# Altium schematic sheet AudioAndWifi.SchDoc: =ProjectTitle
size B; Engineer: H. Collector; Organization: IMR Engineering; Address1: 3621 Gin Way; Address2: Snellville, GA 30039; Address3: USA; SheetNumber: 1; SheetTotal: 7
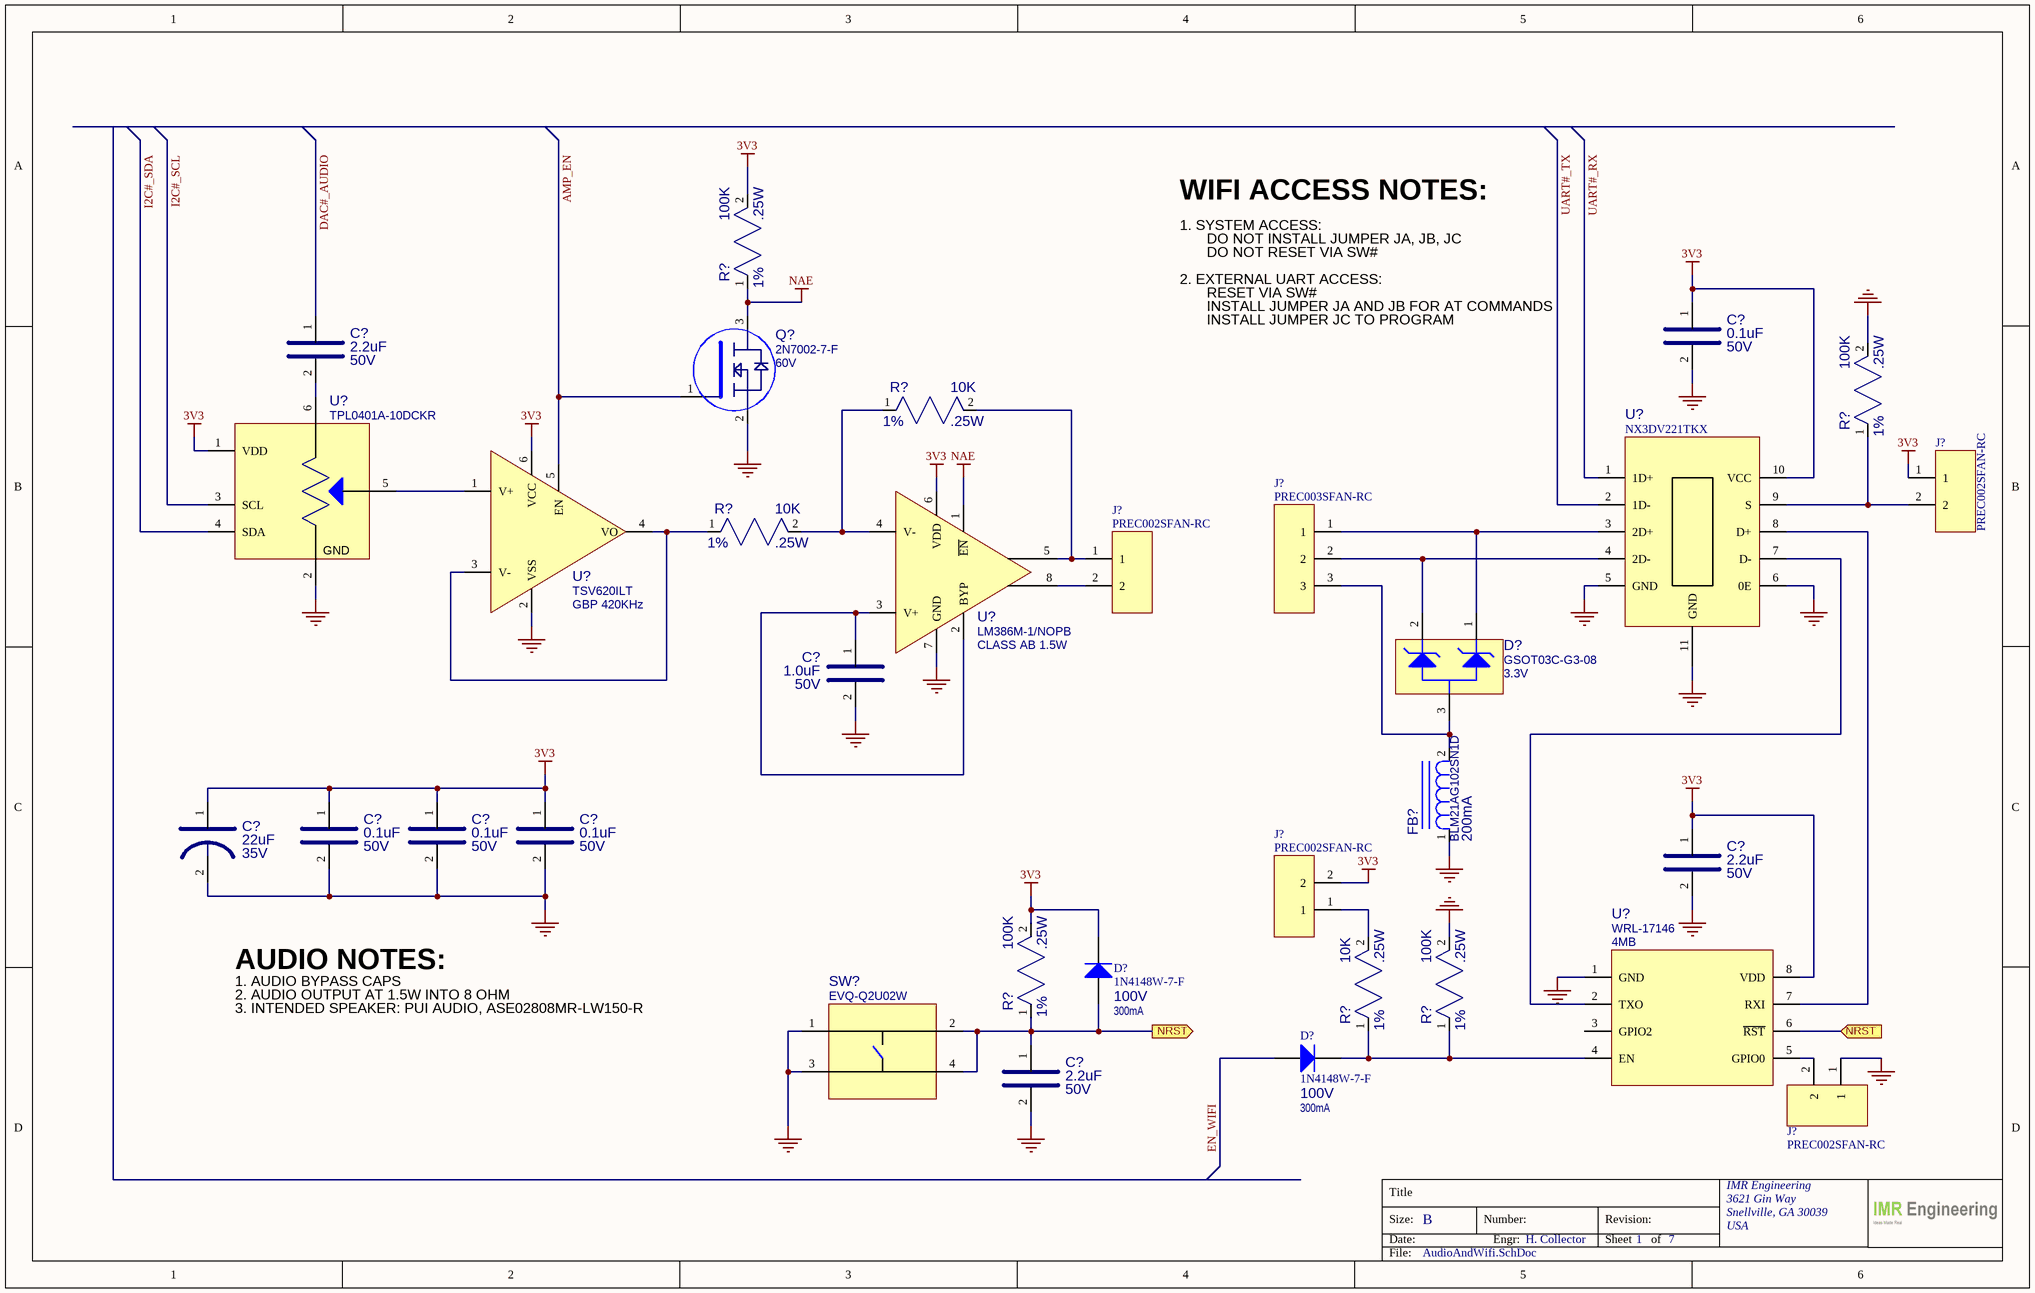
[diagram p0: AudioAndWifi.SchDoc]

## Parts
(Parts that share a designator on the sheet are numbered #1, #2 ... from top to bottom, then left to right.)
C?#1  value 0.1uF  VOLTAGE: 50V  [CAP_0805]  (hidden comment: 08055C104KAT2A)
C?#2  value 2.2uF  VOLTAGE: 50V  [CAP_0805]  (hidden comment: UMK212BB7225MG-T)
C?#3  value 1.0uF  VOLTAGE: 50V  [CAP_0805]  (hidden comment: UMK212B7105MGHT)
C?#4  value 0.1uF  VOLTAGE: 50V  [CAP_0805]  (hidden comment: 08055C104KAT2A)
C?#5  value 0.1uF  VOLTAGE: 50V  [CAP_0805]  (hidden comment: 08055C104KAT2A)
C?#6  value 0.1uF  VOLTAGE: 50V  [CAP_0805]  (hidden comment: 08055C104KAT2A)
C?#7  value 22uF  VOLTAGE: 35V  [CAP_ALE_SMD_6.6x6.6]  (hidden comment: UZS1C220MCL1GB)  (net tie, no BOM)
C?#8  value 2.2uF  VOLTAGE: 50V  [CAP_0805]  (hidden comment: UMK212BB7225MG-T)
C?#9  value 2.2uF  VOLTAGE: 50V  [CAP_0805]  (hidden comment: UMK212BB7225MG-T)
D?#1  value 3.3V  [SOT-23]  (hidden comment: GSOT03C-G3-08)
D?#2  value 100V  CURRENT: 300mA  [SOD123]  (hidden comment: 1N4148W-7-F)
D?#3  value 100V  CURRENT: 300mA  [SOD123]  (hidden comment: 1N4148W-7-F)
FB?  value 200mA  [RES_0805]  (hidden comment: BLM21AG102SN1D)
J?#1  PREC002SFAN-RC  [HDR_1X2_100MILL]
J?#2  PREC003SFAN-RC  [HDR_1X3_100MILL]
J?#3  PREC002SFAN-RC  [HDR_1X2_100MILL]
J?#4  PREC002SFAN-RC  [HDR_1X2_100MILL]
J?#5  PREC002SFAN-RC  [HDR_1X2_100MILL]
Q?  value 60V  [SOT-23]  (hidden comment: 2N7002-7-F)
R?#1  value 100K  TOLERANCE: 1%  POWER: .25W  [PMG_RES_0805]  (hidden comment: RK73H2ATTD1003F)
R?#2  value 10K  TOLERANCE: 1%  POWER: .25W  [RES_0805]  (hidden comment: SG73S2ATTD1002F)
R?#3  value 100K  TOLERANCE: 1%  POWER: .25W  [PMG_RES_0805]  (hidden comment: RK73H2ATTD1003F)
R?#4  value 10K  TOLERANCE: 1%  POWER: .25W  [RES_0805]  (hidden comment: SG73S2ATTD1002F)
R?#5  value 100K  TOLERANCE: 1%  POWER: .25W  [PMG_RES_0805]  (hidden comment: RK73H2ATTD1003F)
R?#6  value 10K  TOLERANCE: 1%  POWER: .25W  [RES_0805]  (hidden comment: SG73S2ATTD1002F)
R?#7  value 100K  TOLERANCE: 1%  POWER: .25W  [PMG_RES_0805]  (hidden comment: RK73H2ATTD1003F)
SW?  EVQ-Q2U02W  [SW_EVQ-Q2U02W]
U?#1  value 10K  TOLERANCE: 20%  POWER: 5.5V  [SOT-363_6-TSSOP_SC-88]  (hidden comment: TPL0401A-10DCKR)
U?#2  value GBP 420KHz  [SOT-363_6-TSSOP_SC-88]  (hidden comment: TSV620ILT)
U?#3  value CLASS AB 1.5W  [SO-8]  (hidden comment: LM386M-1/NOPB)
U?#4  NX3DV221TKX  [PMG_NX3DV221TKX]
U?#5  value 4MB  [WRL-17146]  (hidden comment: WRL-17146)

## Ports
NRST (in), NRST (out)

## Nets
3V3: C?#1.1 C?#4.1 C?#5.1 C?#6.1 C?#7.1 C?#8.1 D?#2.2(K) J?#1.1 J?#4.2 R?#1.2 R?#5.2 U?#1.1(VDD) U?#2.6(VCC) U?#3.6(VDD) U?#4.10(VCC) U?#5.8(VDD)
GND: C?#1.2 C?#3.2 C?#4.2 C?#5.2 C?#6.2 C?#7.2 C?#8.2 C?#9.2 FB?.1 J?#5.1 Q?.2(E) R?#3.2 R?#7.2 SW?.1(B) SW?.3(A) U?#1.2(GND) U?#2.2(VSS) U?#3.7(GND) U?#4.5(GND) U?#4.6(0E) U?#4.11(GND) U?#5.1(GND)
NAE: Q?.3(C) R?#1.1 U?#3.1(~{EN})
AMP_EN: Q?.1(B) U?#2.5(EN)
DAC#_AUDIO: C?#2.1
EN_WIFI: D?#3.1(A)
I2C#_SCL: U?#1.3(SCL)
I2C#_SDA: U?#1.4(SDA)
NRST: C?#9.1 D?#2.1(A) R?#5.1 SW?.2(B') SW?.4(A') U?#5.6(~{RST}) ; port NRST
UART#_RX: U?#4.1(1D+)
UART#_TX: U?#4.2(1D-)
NetC?#2_2: C?#2.2 U?#1.6(H)
NetC?#3_1: C?#3.1 U?#3.2(BYP) U?#3.3(V+)
NetD?#1_1: D?#1.1(A1) J?#2.1 U?#4.3(2D+)
NetD?#1_2: D?#1.2(A2) J?#2.2 U?#4.4(2D-)
NetD?#1_3: D?#1.3(A) FB?.2 J?#2.3
NetD?#3_2: D?#3.2(K) R?#6.1 R?#7.1 U?#5.4(EN)
NetJ?#1_2: J?#1.2 R?#3.1 U?#4.9(S)
NetJ?#3_1: J?#3.1 R?#2.2 U?#3.5(VO1)
NetJ?#3_2: J?#3.2 U?#3.8(VO2)
NetJ?#4_1: J?#4.1 R?#6.2
NetJ?#5_2: J?#5.2 U?#5.5(GPIO0)
NetR?#2_1: R?#2.1 R?#4.2 U?#3.4(V-)
NetR?#4_1: R?#4.1 U?#2.3(V-) U?#2.4(VO)
NetU?#1_5: U?#1.5(W) U?#2.1(V+)
NetU?#4_7: U?#4.7(D-) U?#5.2(TXO)
NetU?#4_8: U?#4.8(D+) U?#5.7(RXI)

Not connected (* = marked no-connect by the designer): U?#5 3(GPIO2)

## Notes on the sheet
- WIFI ACCESS NOTES:
- 1. SYSTEM ACCESS:
- 2. EXTERNAL UART ACCESS:
- DO NOT INSTALL JUMPER JA, JB, JC
- DO NOT RESET VIA SW#
- RESET VIA SW#
- INSTALL JUMPER JA AND JB FOR AT COMMANDS
- INSTALL JUMPER JC TO PROGRAM
- AUDIO NOTES:
- 1. AUDIO BYPASS CAPS
- 2. AUDIO OUTPUT AT 1.5W INTO 8 OHM
- 3. INTENDED SPEAKER: PUI AUDIO, ASE02808MR-LW150-R
- Title
- Size:
- Date:
- B
- Number:
- Engr:
- Revision:
- Sheet
- of
- File:

## Library data of the parts
C?#1 C?#4-C?#6 = CAP_0.1UF_50V_0805: CAP CER 0.1UF 50V X7R 0805; MFG: AVX; TOLERANCE: 10%; MFG_PN: 08055C104KAT2A; Supplier 1: Digi-Key; Supplier Part Number 1: 478-1395-1-ND; Case/Package: 0805
C?#2 C?#8 C?#9 = CAP_2.2UF_50V_0805: CAP CER 2.2UF 50V X7R 0805; MFG: Taiyo Yuden; TOLERANCE: 20%; MFG_PN: UMK212BB7225MG-T; Supplier 1: Digi-Key; Supplier Part Number 1: 587-4963-1-ND; Case/Package: 0805
C?#3 = CAP_1.0UF_50V_0805: CAP CER 1UF 50V X7R 0805; MFG: Taiyo Yuden; TOLERANCE: 20%; MFG_PN: UMK212B7105MGHT; Supplier 1: Digi-Key; Supplier Part Number 1: 587-6375-1-ND; Case/Package: 0805
C?#7 = CAP_22UF_35V_ALE_NF: CAP, AL E, 22UF, 35V, 20%, ROHS; MFG: NICHICON; MFG_PN: UZS1C220MCL1GB; TOLERANCE: 20%; Supplier 1: Digi-Key; Supplier Part Number 1: 493-10138-1-ND
D?#1 = DIODE_TVS_GSOT03C-G3-08: TVS DIODE 3.3V 12.3V SOT23; MFG: Vishay Semiconductor; POWER: 30A (8/20us); Case/Package: SOT-23; Supplier 1: Digi-Key; Supplier Part Number 1: GSOT03C-G3-08GICT-ND; MFG_PN: GSOT03C-G3-08
D?#2 D?#3 = DIODE_1N4148W-7-F: DIODE GEN PURP 100V 300MA SOD123; MFG: Diodes Incorporated; Case/Package: SOD-123; Supplier 1: Digi-Key; Supplier Part Number 1: 1N4148W-FDICT-ND; MFG_PN: 1N4148W-7-F
FB? = FERRITE_BLM21AG102SN1D: FERRITE, 1KOHM AT 100MHZ, 220MA, .450DCR; MFG: MURATA; TOLERANCE: 10%; Supplier 1: Digi-Key; Supplier Part Number 1: 490-1041-1-ND; MFG_PN: BLM21AG102SN1D
J?#1 J?#3-J?#5 = CONN_2P_SINGLE_ROW: CONN HEADER VERT 2POS 2.54MM; MFG: Sullins Connector Solutions; Case/Package: 2P_2.54MM; MFG_PN: PREC002SFAN-RC; Supplier 1: Digi-Key; Supplier Part Number 1: S1212EC-02-ND; Value: *
J?#2 = CONN_3P_SINGLE_ROW: CONN HEADER VERT 3POS 2.54MM; MFG: Sullins Connector Solutions; Case/Package: 3P_2.54MM; MFG_PN: PREC003SFAN-RC; Supplier 1: Digi-Key; Supplier Part Number 1: S1212EC-03-ND; Value: *
Q? = MOSFET_NCH_2N7002-7-F: MOSFET N-CH 60V 115MA SOT23-3; MFG: Diodes Incorporated; Case/Package: SOT-23; Supplier 1: Digi-Key; Supplier Part Number 1: 2N7002-FDICT-ND; MFG_PN: 2N7002-7-F
R?#1 R?#3 R?#5 R?#7 = RES_100K_0805_1/4W_1%: RES SMD 100K OHM 1% 1/4W 0805; MFG: KOA Speer Electronics, Inc.; Case/Package: 0805; MFG_PN: RK73H2ATTD1003F; Supplier 1: Digi-Key; Supplier Part Number 1: 2019-RK73H2ATTD1003FCT-ND
R?#2 R?#4 R?#6 = RES_10K_0805_1/4W_1%: RES SMD 10K OHM 1% 1/4W 0805; MFG: KOA Speer Electronics, Inc.; Case/Package: 0805; MFG_PN: SG73S2ATTD1002F; Supplier 1: Digi-Key; Supplier Part Number 1: 2019-SG73S2ATTD1002FCT-ND
SW? = SWITCH_EVQ-Q2U02W: SWITCH TACTILE SPST-NO 0.02A 15V; MFG: Panasonic Electronic Components; Case/Package: EVQ-Q2; Supplier 1: Digi-Key; Supplier Part Number 1: P12954SCT-ND; VALUE: 15V; MFG_PN: EVQ-Q2U02W
U?#1 = IC_TPL0401A-10DCKR: IC DGTL POT 10KOHM 128TAP SC70-6; MFG: Texas Instruments; Case/Package: SC70-6; MFG_PN: TPL0401A-10DCKR; Supplier 1: Digi-Key; Supplier Part Number 1: 296-29676-1-ND
U?#2 = IC_OPAMP_TSV620ILT: IC OPAMP GP 1 CIRCUIT SOT23-6; MFG: STMicroelectronics; Supplier 1: Digi-Key; Supplier Part Number 1: 497-10160-1-ND; Case/Package: SOT23-6; MFG_PN: TSV620ILT
U?#3 = IC_OPAMP_LM4861: IC AMP CLASS AB MONO 1.5W 8SOIC; MFG: Texas Instruments; Supplier 1: Digi-Key; Supplier Part Number 1: 296-38566-1-ND; Case/Package: 8SOIC; MFG_PN: LM386M-1/NOPB
U?#4 = IC_NX3DV221TKX: IC USB 2.0 SWITCH HS 10HVSON; MFG: NXP USA Inc.; Case/Package: 10-DFN; Supplier 1: Digi-Key; Supplier Part Number 1: 568-10368-1-ND; MFG_PN: NX3DV221TKX
U?#5 = MODULE_WRL-1746: WIFI MODULE - ESP8266 4MB FLASH; MFG: Sparkfun; Supplier 1: Digi-Key; Case/Package: WRL-1746; MFG_PN: WRL-17146